# Altium schematic sheet project_name_lpc1768.SchDoc
size A4
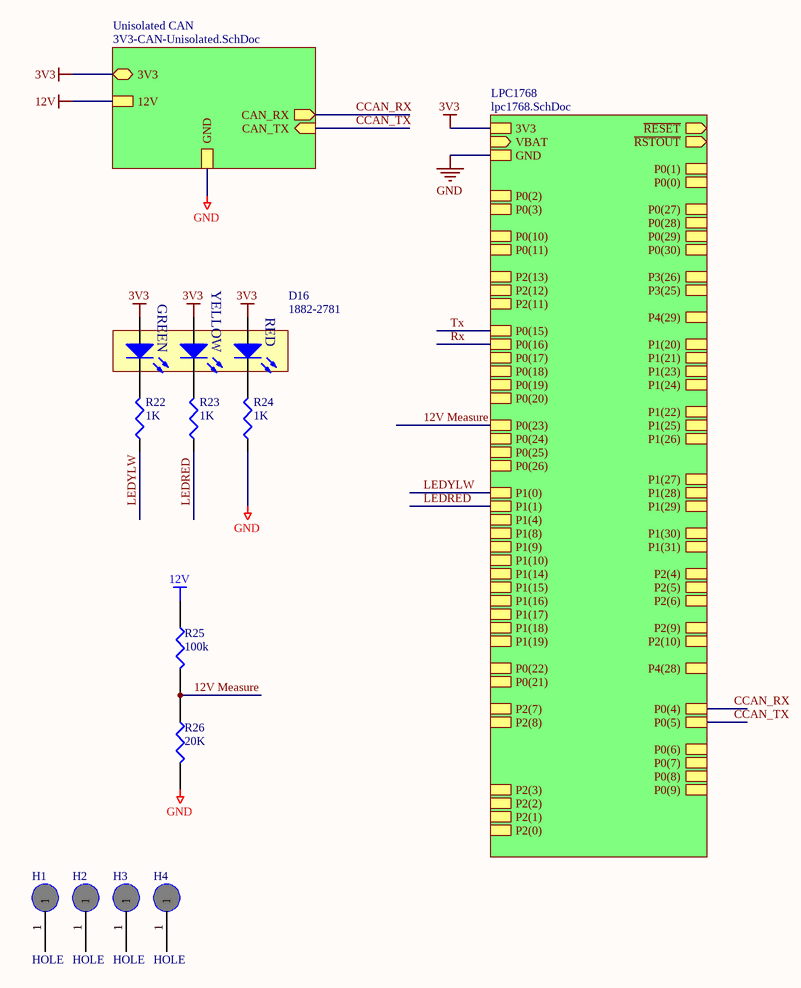
[diagram p0: project_name_lpc1768.SchDoc]

## Parts
D16  1882-2781  [LED_TRILEVEL]
H1  HOLE  [M2.5]
H2  HOLE  [M2.5]
H3  HOLE  [M2.5]
H4  HOLE  [M2.5]
R22  1K  [0603]
R23  1K  [0603]
R24  1K  [0603]
R25  100k  [1206]
R26  20K  [1206]

## Sub-sheets
LPC1768 = lpc1768.SchDoc: P0(26), P0(25), P0(24), P0(23), P1(31), P1(30), P0(28), P0(27), P3(26), P3(25), P0(29), P0(30), P1(18), P1(19), P1(20), P1(21), P1(22), P1(24), P1(23), P1(25), P1(26), P1(27), P1(28), P1(29), P0(0), P0(1), P0(10), P0(11), P2(13), P2(12), P2(11), P2(10), P0(22), P0(21), P0(20), P0(19), P0(18), P0(17), P0(15), P0(16), P2(9), P2(8), P2(7), P2(6), P2(5), P2(4), P2(3), P2(2), P2(1), P2(0), P0(2), P0(3), P1(0), P1(1), P1(4), P1(8), P1(9), P1(10), P1(14), P1(15), P1(16), P1(17), P0(4), P0(5), P0(6), P0(7), P0(8), P0(9), P4(29), P4(28), GND, 3V3, ~{RSTOUT}, ~{RESET}, VBAT (in)
Unisolated CAN = 3V3-CAN-Unisolated.SchDoc: 12V, GND, 3V3, CAN_RX (out), CAN_TX (in)

## Nets
3V3: D16.4(A) D16.5(A) D16.6(A) ; sheet Unisolated CAN/3V3, sheet LPC1768/3V3
12V: R25.1 ; sheet Unisolated CAN/12V
GND: R24.1 R26.2 ; sheet Unisolated CAN/GND, sheet LPC1768/GND
12V Measure: R25.2 R26.1 ; sheet LPC1768/P0(23)
CCAN_RX: sheet Unisolated CAN/CAN_RX, sheet LPC1768/P0(4)
CCAN_TX: sheet Unisolated CAN/CAN_TX, sheet LPC1768/P0(5)
LEDRED: R23.1 ; sheet LPC1768/P1(1)
LEDYLW: R22.1 ; sheet LPC1768/P1(0)
Rx: sheet LPC1768/P0(16)
Tx: sheet LPC1768/P0(15)
NetD16_1: D16.1(K) R22.2
NetD16_2: D16.2(K) R23.2
NetD16_3: D16.3(K) R24.2

Not connected (* = marked no-connect by the designer): H1 1; H2 1; H3 1; H4 1

## Notes on the sheet
- (in symbol LED-TRILEVEL) YELLOW; GREEN; RED

## Library data of the parts
D16 = LED-TRILEVEL: Three level LED; Element14 (low stock): 1461596; Element14 Price: 4.56; Digikey: 350-1751-ND; Digikey Price: 2.84
R22-R24 = RES1: Resistor; Farnell: *
R25 R26 = RES1: Price: 1.010
  R25: Farnell: 308-6422
  R26: Farnell: 308-6252